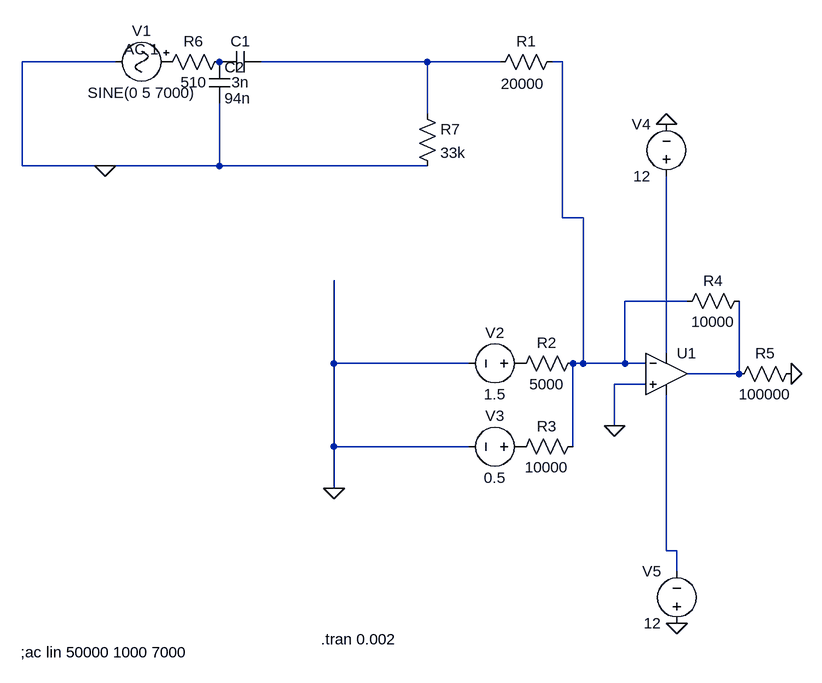
[diagram p0: schematic Draft2.asc]
Draft2.asc, the LTspice schematic file:
Version 4
SHEET 1 880 684
WIRE -672 -240 -816 -240
WIRE -192 -240 -448 -240
WIRE -80 -240 -192 -240
WIRE 16 -240 0 -240
WIRE -192 -160 -192 -240
WIRE -816 -80 -816 -240
WIRE -688 -80 -816 -80
WIRE -512 -80 -512 -176
WIRE -512 -80 -688 -80
WIRE -192 -80 -512 -80
WIRE 16 0 16 -240
WIRE 48 0 16 0
WIRE 208 128 112 128
WIRE 176 208 176 -64
WIRE -336 224 -336 96
WIRE -128 224 -336 224
WIRE 48 224 48 0
WIRE 48 224 32 224
WIRE 112 224 112 128
WIRE 112 224 48 224
WIRE 144 224 112 224
WIRE 288 240 288 128
WIRE 288 240 208 240
WIRE 144 256 96 256
WIRE 96 320 96 256
WIRE -336 352 -336 224
WIRE -128 352 -336 352
WIRE 32 352 32 224
WIRE -336 416 -336 352
WIRE 176 512 176 272
WIRE 192 512 176 512
WIRE 192 544 192 512
FLAG -336 416 0
FLAG 96 320 0
FLAG 176 -144 0
FLAG 192 624 0
FLAG 368 240 0
FLAG -688 -80 0
SYMBOL res 16 -256 R90
WINDOW 0 0 56 VBottom 2
WINDOW 3 34 61 VTop 2
SYMATTR InstName R1
SYMATTR Value 20000
SYMBOL res 48 208 R90
WINDOW 0 0 56 VBottom 2
WINDOW 3 32 56 VTop 2
SYMATTR InstName R2
SYMATTR Value 5000
SYMBOL res 48 336 R90
WINDOW 0 0 56 VBottom 2
WINDOW 3 32 56 VTop 2
SYMATTR InstName R3
SYMATTR Value 10000
SYMBOL voltage 176 -48 R180
WINDOW 0 24 96 Left 2
WINDOW 3 24 16 Left 2
WINDOW 123 0 0 Left 0
WINDOW 39 0 0 Left 0
SYMATTR InstName V4
SYMATTR Value 12
SYMBOL voltage 192 640 R180
WINDOW 0 24 96 Left 2
WINDOW 3 24 16 Left 2
WINDOW 123 0 0 Left 0
WINDOW 39 0 0 Left 0
SYMATTR InstName V5
SYMATTR Value 12
SYMBOL res 304 112 R90
WINDOW 0 0 56 VBottom 2
WINDOW 3 32 56 VTop 2
SYMATTR InstName R4
SYMATTR Value 10000
SYMBOL res 384 224 R90
WINDOW 0 0 56 VBottom 2
WINDOW 3 32 56 VTop 2
SYMATTR InstName R5
SYMATTR Value 100000
SYMBOL Misc\\signal -576 -240 R90
WINDOW 0 -32 56 VBottom 2
WINDOW 3 32 56 VTop 2
WINDOW 123 -4 56 VBottom 2
WINDOW 39 0 0 Left 0
SYMATTR InstName V1
SYMATTR Value SINE(0 5 7000)
SYMATTR Value2 AC 1
SYMBOL voltage -32 224 R90
WINDOW 0 -32 56 VBottom 2
WINDOW 3 32 56 VTop 2
WINDOW 123 0 0 Left 0
WINDOW 39 0 0 Left 0
SYMATTR InstName V2
SYMATTR Value 1.5
SYMBOL voltage -32 352 R90
WINDOW 0 -32 56 VBottom 2
WINDOW 3 32 56 VTop 2
WINDOW 123 0 0 Left 0
WINDOW 39 0 0 Left 0
SYMATTR InstName V3
SYMATTR Value 0.5
SYMBOL Opamps\\UniversalOpamp2 176 240 R0
SYMATTR InstName U1
SYMBOL res -496 -256 R90
WINDOW 0 0 56 VBottom 2
WINDOW 3 32 56 VTop 2
SYMATTR InstName R6
SYMATTR Value 510
SYMBOL cap -448 -256 R90
WINDOW 0 0 32 VBottom 2
WINDOW 3 32 32 VTop 2
SYMATTR InstName C1
SYMATTR Value 3n
SYMBOL cap -528 -240 R0
SYMATTR InstName C2
SYMATTR Value 94n
SYMBOL res -208 -176 R0
SYMATTR InstName R7
SYMATTR Value 33k
TEXT -356 648 Left 2 !.tran 0.002
TEXT -818 668 Left 2 !;ac lin 50000 1000 7000

The netlist it stands for:
* Draft2.asc
R1 N002 N001 20000
R2 N002 P001 5000
R3 N002 P002 10000
V4 N003 0 12
V5 0 N005 12
R4 N004 N002 10000
R5 0 N004 100000
V1 P003 0 SINE(0 5 7000) AC 1
V2 P001 0 1.5
V3 P002 0 0.5
XU1 0 N002 N003 N005 N004 level.2 Avol=1Meg GBW=10Meg Slew=10Meg ilimit=25m rail=0 Vos=0 phimargin=45 en=0 enk=0 in=0 ink=0 Rin=500Meg  ; pins IN+ IN- V+ V- OUT
R6 P004 P003 510
C1 N001 P004 3n
C2 P004 0 94n
R7 N001 0 33k
.tran 0.002
;ac lin 50000 1000 7000
.lib UniversalOpamps2.sub
.backanno
.end